# Altium schematic sheet Connector.SchDoc
size A4
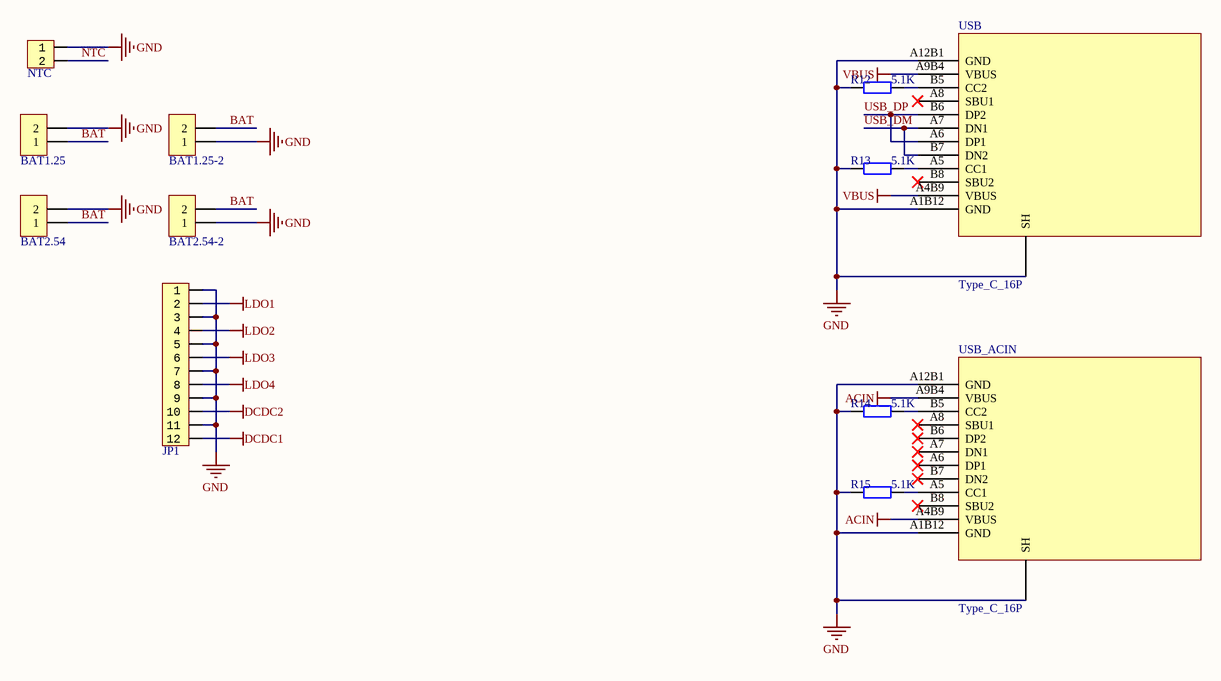
[diagram p0: Connector.SchDoc]

## Parts
BAT1.25  HDR-1X2  [MX 1.25-WS-2P]  (value not drawn)
BAT1.25-2  HDR-1X2  [MX 1.25-WS-2P]  (value not drawn)
BAT2.54  HDR-1X2  [XH2.54-WS-2P]  (value not drawn)
BAT2.54-2  HDR-1X2  [XH2.54-WS-2P]  (value not drawn)
JP1  HDR1x12_2.54T  [HDR1X12_2.54_90]  (value not drawn)
NTC  HDR1x2_1.27T  [HDR1X2_1.27_180]  (value not drawn)
R12  5.1K  [R 0603_L]
R13  5.1K  [R 0603_L]
R14  5.1K  [R 0603_L]
R15  5.1K  [R 0603_L]
USB  Type_C_16P  [Type_C_16P]
USB_ACIN  Type_C_16P  [Type_C_16P]

## Nets
ACIN: USB_ACIN.A4B9(VBUS) USB_ACIN.A9B4(VBUS)
DCDC1: JP1.12
DCDC2: JP1.10
GND: BAT1.25.2 BAT1.25-2.1 BAT2.54.2 BAT2.54-2.1 JP1.1 JP1.3 JP1.5 JP1.7 JP1.9 JP1.11 NTC.1 R12.1 R13.1 R14.1 R15.1 USB.0(SH) USB.A1B12(GND) USB.A12B1(GND) USB_ACIN.0(SH) USB_ACIN.A1B12(GND) USB_ACIN.A12B1(GND)
LDO1: JP1.2
LDO2: JP1.4
LDO3: JP1.6
LDO4: JP1.8
VBUS: USB.A4B9(VBUS) USB.A9B4(VBUS)
BAT: BAT1.25.1 BAT1.25-2.2 BAT2.54.1 BAT2.54-2.2
NTC: NTC.2
USB_DM: USB.A7(DN1) USB.B7(DN2)
USB_DP: USB.A6(DP1) USB.B6(DP2)
NetR12_2: R12.2 USB.B5(CC2)
NetR13_2: R13.2 USB.A5(CC1)
NetR14_2: R14.2 USB_ACIN.B5(CC2)
NetR15_2: R15.2 USB_ACIN.A5(CC1)

Not connected (* = marked no-connect by the designer): USB A8(SBU1)* B8(SBU2)*; USB_ACIN A6(DP1)* A7(DN1)* A8(SBU1)* B6(DP2)* B7(DN2)* B8(SBU2)*

## Library data of the parts
BAT1.25 BAT1.25-2 BAT2.54 BAT2.54-2 = Header 2: 2P接插件; 版权归属: 源创客; BOM名称: 2P接插件; 学习资源: www.ooocke.com
JP1 = HDR1x12_2.54T: Header
NTC = HDR1x2_1.27T: Header
R12-R15 = R: 贴片电阻; 版权归属: 源创客; BOM名称: 贴片电阻; 学习资源: www.ooocke.com